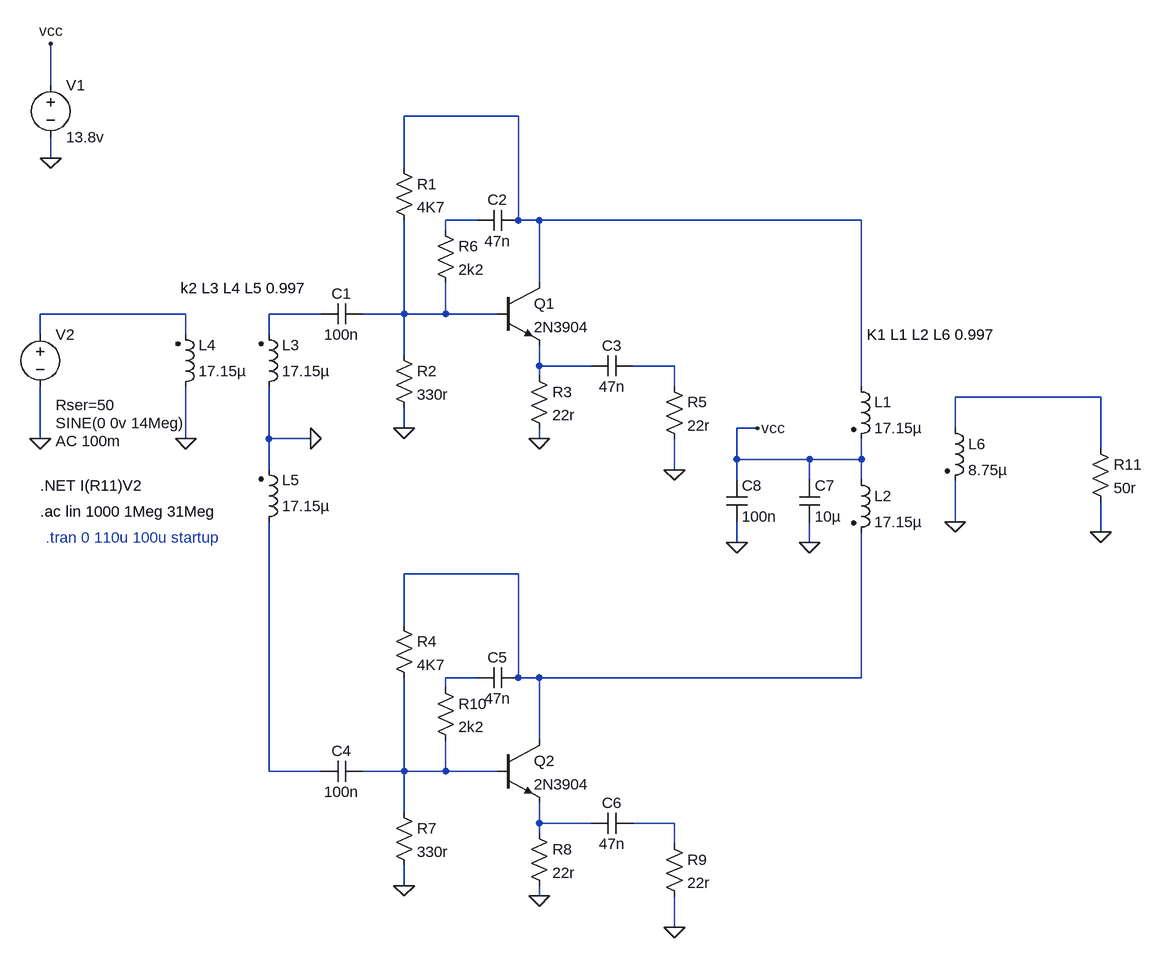
[diagram p0: schematic 2n3904_push_pull_single_ac.asc]
2n3904_push_pull_single_ac.asc, the LTspice schematic file:
Version 4
SHEET 1 2192 1460
WIRE -448 -192 -448 -256
WIRE 272 -144 96 -144
WIRE -448 -80 -448 -112
WIRE 96 -64 96 -144
WIRE 208 16 160 16
WIRE 272 16 272 -144
WIRE 304 16 272 16
WIRE 800 16 304 16
WIRE 160 32 160 16
WIRE 304 112 304 16
WIRE -240 160 -464 160
WIRE -32 160 -112 160
WIRE 96 160 96 16
WIRE 96 160 32 160
WIRE 160 160 160 112
WIRE 160 160 96 160
WIRE 240 160 160 160
WIRE -464 192 -464 160
WIRE -240 192 -240 160
WIRE -112 192 -112 160
WIRE 96 224 96 160
WIRE 304 240 304 208
WIRE 384 240 304 240
WIRE 512 240 448 240
WIRE 304 256 304 240
WIRE 512 272 512 240
WIRE 800 272 800 16
WIRE 1168 288 944 288
WIRE 96 336 96 304
WIRE 640 336 608 336
WIRE 944 336 944 288
WIRE -464 352 -464 272
WIRE -240 352 -240 272
WIRE -112 352 -112 272
WIRE -48 352 -112 352
WIRE 304 352 304 336
WIRE 1168 368 1168 288
WIRE 608 384 608 336
WIRE 720 384 608 384
WIRE 800 384 800 352
WIRE 800 384 720 384
WIRE -112 400 -112 352
WIRE 512 400 512 352
WIRE 608 416 608 384
WIRE 720 416 720 384
WIRE 800 416 800 384
WIRE 944 480 944 416
WIRE 1168 496 1168 448
WIRE 608 512 608 480
WIRE 720 512 720 480
WIRE 272 560 96 560
WIRE 96 640 96 560
WIRE 208 720 160 720
WIRE 272 720 272 560
WIRE 304 720 272 720
WIRE 800 720 800 496
WIRE 800 720 304 720
WIRE 160 736 160 720
WIRE 304 816 304 720
WIRE -112 864 -112 480
WIRE -32 864 -112 864
WIRE 96 864 96 720
WIRE 96 864 32 864
WIRE 160 864 160 816
WIRE 160 864 96 864
WIRE 240 864 160 864
WIRE 96 928 96 864
WIRE 304 944 304 912
WIRE 384 944 304 944
WIRE 512 944 448 944
WIRE 304 960 304 944
WIRE 512 976 512 944
WIRE 96 1040 96 1008
WIRE 304 1056 304 1040
WIRE 512 1104 512 1056
FLAG 304 352 0
FLAG -448 -80 0
FLAG -448 -256 vcc
FLAG -464 352 0
FLAG 512 400 0
FLAG -240 352 0
FLAG 304 1056 0
FLAG 512 1104 0
FLAG -48 352 0
FLAG 944 480 0
FLAG 1168 496 0
FLAG 640 336 vcc
FLAG 608 512 0
FLAG 720 512 0
FLAG 96 336 0
FLAG 96 1040 0
SYMBOL res 80 -80 R0
SYMATTR InstName R1
SYMATTR Value 4K7
SYMBOL res 80 208 R0
SYMATTR InstName R2
SYMATTR Value 330r
SYMBOL res 288 240 R0
SYMATTR InstName R3
SYMATTR Value 22r
SYMBOL voltage -448 -208 R0
WINDOW 123 0 0 Left 0
WINDOW 39 0 0 Left 0
SYMATTR InstName V1
SYMATTR Value 13.8v
SYMBOL cap 32 144 R90
WINDOW 0 0 32 VBottom 2
WINDOW 3 32 32 VTop 2
SYMATTR InstName C1
SYMATTR Value 100n
SYMBOL voltage -464 176 R0
WINDOW 3 24 152 Left 2
WINDOW 123 24 180 Left 2
WINDOW 39 24 124 Left 2
SYMATTR Value SINE(0 0v 14Meg)
SYMATTR Value2 AC 100m
SYMATTR SpiceLine Rser=50
SYMATTR InstName V2
SYMBOL cap 272 0 R90
WINDOW 0 0 32 VBottom 2
WINDOW 3 32 32 VTop 2
SYMATTR InstName C2
SYMATTR Value 47n
SYMBOL cap 448 224 R90
WINDOW 0 0 32 VBottom 2
WINDOW 3 32 32 VTop 2
SYMATTR InstName C3
SYMATTR Value 47n
SYMBOL res 496 256 R0
SYMATTR InstName R5
SYMATTR Value 22r
SYMBOL res 144 16 R0
SYMATTR InstName R6
SYMATTR Value 2k2
SYMBOL ind2 -128 288 M180
WINDOW 0 36 80 Left 2
WINDOW 3 36 40 Left 2
SYMATTR InstName L3
SYMATTR Value 17.15µ
SYMATTR Type ind
SYMATTR SpiceLine Rser=1R
SYMBOL ind2 -256 288 M180
WINDOW 0 36 80 Left 2
WINDOW 3 36 40 Left 2
SYMATTR InstName L4
SYMATTR Value 17.15µ
SYMATTR Type ind
SYMATTR SpiceLine Rser=1R
SYMBOL res 80 624 R0
SYMATTR InstName R4
SYMATTR Value 4K7
SYMBOL res 288 944 R0
SYMATTR InstName R8
SYMATTR Value 22r
SYMBOL cap 32 848 R90
WINDOW 0 0 32 VBottom 2
WINDOW 3 32 32 VTop 2
SYMATTR InstName C4
SYMATTR Value 100n
SYMBOL cap 272 704 R90
WINDOW 0 0 32 VBottom 2
WINDOW 3 32 32 VTop 2
SYMATTR InstName C5
SYMATTR Value 47n
SYMBOL cap 448 928 R90
WINDOW 0 0 32 VBottom 2
WINDOW 3 32 32 VTop 2
SYMATTR InstName C6
SYMATTR Value 47n
SYMBOL res 496 960 R0
SYMATTR InstName R9
SYMATTR Value 22r
SYMBOL res 144 720 R0
SYMATTR InstName R10
SYMATTR Value 2k2
SYMBOL ind2 -128 496 M180
WINDOW 0 36 80 Left 2
WINDOW 3 36 40 Left 2
SYMATTR InstName L5
SYMATTR Value 17.15µ
SYMATTR Type ind
SYMATTR SpiceLine Rser=1R
SYMBOL ind2 784 256 R0
SYMATTR InstName L1
SYMATTR Value 17.15µ
SYMATTR Type ind
SYMATTR SpiceLine Rser=1R
SYMBOL ind2 784 400 R0
SYMATTR InstName L2
SYMATTR Value 17.15µ
SYMATTR Type ind
SYMATTR SpiceLine Rser=1R
SYMBOL ind2 928 320 R0
SYMATTR InstName L6
SYMATTR Value 8.75µ
SYMATTR Type ind
SYMATTR SpiceLine Rser=1R
SYMBOL res 1152 352 R0
SYMATTR InstName R11
SYMATTR Value 50r
SYMBOL npn 240 816 R0
SYMATTR InstName Q2
SYMATTR Value 2N3904
SYMBOL npn 240 112 R0
SYMATTR InstName Q1
SYMATTR Value 2N3904
SYMBOL cap 704 416 R0
SYMATTR InstName C7
SYMATTR Value 10µ
SYMBOL cap 592 416 R0
SYMATTR InstName C8
SYMATTR Value 100n
SYMBOL res 80 912 R0
SYMATTR InstName R7
SYMATTR Value 330r
TEXT -464 424 Left 2 !.NET I(R11)V2
TEXT -464 464 Left 2 !.ac lin 1000 1Meg 31Meg
TEXT -248 120 Left 2 !k2 L3 L4 L5 0.997
TEXT 808 192 Left 2 !K1 L1 L2 L6 0.997
TEXT -456 504 Left 2 ;.tran 0 110u 100u startup

The netlist it stands for:
* 2n3904_push_pull_single_ac.asc
R1 N001 N005 4K7
R2 N005 0 330r
R3 N006 0 22r
V1 vcc 0 13.8v
C1 N005 N004 100n
V2 N003 0 SINE(0 0v 14Meg) AC 100m Rser=50
C2 N001 N002 47n
C3 N007 N006 47n
R5 N007 0 22r
R6 N002 N005 2k2
L3 0 N004 17.15µ Rser=1R
L4 0 N003 17.15µ Rser=1R
R4 N009 N012 4K7
R8 N013 0 22r
C4 N012 N011 100n
C5 N009 N010 47n
C6 N014 N013 47n
R9 N014 0 22r
R10 N010 N012 2k2
L5 N011 0 17.15µ Rser=1R
L1 N001 vcc 17.15µ Rser=1R
L2 vcc N009 17.15µ Rser=1R
L6 N008 0 8.75µ Rser=1R
R11 N008 0 50r
Q2 N009 N012 N013 0 2N3904
Q1 N001 N005 N006 0 2N3904
C7 vcc 0 10µ
C8 vcc 0 100n
R7 N012 0 330r
.model NPN NPN
.model PNP PNP
.lib standard.bjt
.NET I(R11)V2
.ac lin 1000 1Meg 31Meg
k2 L3 L4 L5 0.997
K1 L1 L2 L6 0.997
* .tran 0 110u 100u startup
.backanno
.end